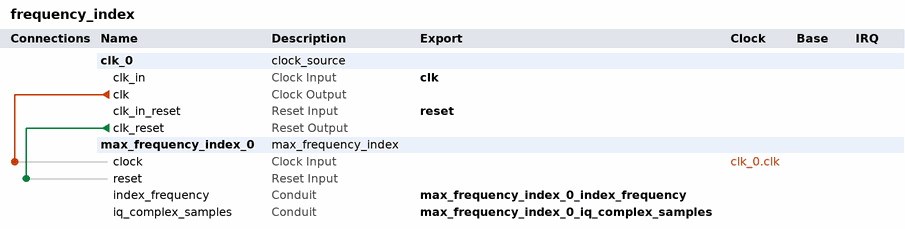
[diagram p0: system contents]
# Platform Designer (Qsys) system frequency_index, Cyclone V 5CEBA4F23C8
# Parameters at their usual value, and those the tool derives, are not listed.
package require -exact qsys 20.1
create_system frequency_index
set_project_property DEVICE_FAMILY {Cyclone V}
set_project_property DEVICE 5CEBA4F23C8

add_instance clk_0 clock_source 20.1
set_instance_parameter_value clk_0 clockFrequency 50000000

add_instance max_frequency_index_0 max_frequency_index 1.0

# connections
add_connection clk_0.clk max_frequency_index_0.clock clock
add_connection clk_0.clk_reset max_frequency_index_0.reset reset

# exported interfaces
add_interface clk clock sink
set_interface_property clk EXPORT_OF clk_0.clk_in
add_interface max_frequency_index_0_index_frequency conduit end
set_interface_property max_frequency_index_0_index_frequency EXPORT_OF max_frequency_index_0.index_frequency
add_interface max_frequency_index_0_iq_complex_samples conduit end
set_interface_property max_frequency_index_0_iq_complex_samples EXPORT_OF max_frequency_index_0.iq_complex_samples
add_interface reset reset sink
set_interface_property reset EXPORT_OF clk_0.clk_in_reset

set_interconnect_requirement {$system} qsys_mm.clockCrossingAdapter HANDSHAKE
set_interconnect_requirement {$system} qsys_mm.enableEccProtection FALSE
set_interconnect_requirement {$system} qsys_mm.insertDefaultSlave FALSE
set_interconnect_requirement {$system} qsys_mm.maxAdditionalLatency 1

save_system frequency_index.qsys
